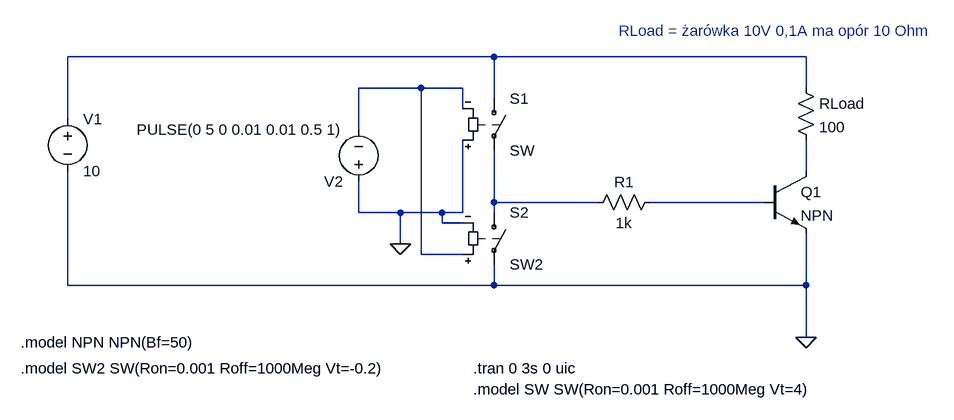
[diagram p0: schematic schemat.asc]
schemat.asc, the LTspice schematic file:
Version 4
SHEET 1 880 680
WIRE -144 -160 -800 -160
WIRE 336 -160 -144 -160
WIRE -256 -112 -352 -112
WIRE -192 -112 -256 -112
WIRE 336 -112 336 -160
WIRE -144 -96 -144 -160
WIRE -192 -80 -192 -112
WIRE -800 -64 -800 -160
WIRE -352 -48 -352 -112
WIRE 336 16 336 -32
WIRE -144 64 -144 -16
WIRE 16 64 -144 64
WIRE 272 64 96 64
WIRE -352 80 -352 32
WIRE -288 80 -352 80
WIRE -224 80 -288 80
WIRE -192 80 -192 -32
WIRE -192 80 -224 80
WIRE -144 80 -144 64
WIRE -224 96 -224 80
WIRE -192 96 -224 96
WIRE -288 128 -288 80
WIRE -256 144 -256 -112
WIRE -192 144 -256 144
WIRE -800 192 -800 16
WIRE -144 192 -144 160
WIRE -144 192 -800 192
WIRE 336 192 336 112
WIRE 336 192 -144 192
WIRE 336 272 336 192
FLAG 336 272 0
FLAG -288 128 0
SYMBOL voltage -800 -80 R0
WINDOW 123 24 124 Left 2
WINDOW 39 0 0 Left 0
SYMATTR InstName V1
SYMATTR Value 10
SYMBOL res 320 -128 R0
SYMATTR InstName RLoad
SYMATTR Value 100
SYMBOL sw -144 -112 R0
SYMATTR InstName S1
SYMBOL voltage -352 48 R180
WINDOW 123 0 0 Left 0
WINDOW 39 0 0 Left 0
SYMATTR InstName V2
SYMATTR Value PULSE(0 5 0 0.01 0.01 0.5 1)
SYMBOL res 112 48 R90
WINDOW 0 0 56 VBottom 2
WINDOW 3 32 56 VTop 2
SYMATTR InstName R1
SYMATTR Value 1k
SYMBOL npn 272 16 R0
SYMATTR InstName Q1
SYMBOL sw -144 64 R0
SYMATTR InstName S2
SYMATTR Value SW2
TEXT 48 -200 Left 2 ;RLoad = żarówka 10V 0,1A ma opór 10 Ohm
TEXT -176 352 Left 2 !.model SW SW(Ron=0.001 Roff=1000Meg Vt=4)
TEXT -176 320 Left 2 !.tran 0 3s 0 uic
TEXT -872 320 Left 2 !.model SW2 SW(Ron=0.001 Roff=1000Meg Vt=-0.2)
TEXT -872 280 Left 2 !.model NPN NPN(Bf=50)

The netlist it stands for:
* schemat.asc
V1 N001 0 10
RLoad N001 N003 100
S1 N001 N004 0 N002 SW
V2 0 N002 PULSE(0 5 0 0.01 0.01 0.5 1)
R1 N005 N004 1k
Q1 N003 N005 0 0 NPN
S2 N004 0 N002 0 SW2
.model NPN NPN
.model PNP PNP
.lib standard.bjt
* RLoad = żarówka 10V 0,1A ma opór 10 Ohm
.model SW SW(Ron=0.001 Roff=1000Meg Vt=4)
.tran 0 3s 0 uic
.model SW2 SW(Ron=0.001 Roff=1000Meg Vt=-0.2)
.model NPN NPN(Bf=50)
.backanno
.end